# EAGLE design anti1_bot (EAGLE 9.5.1)
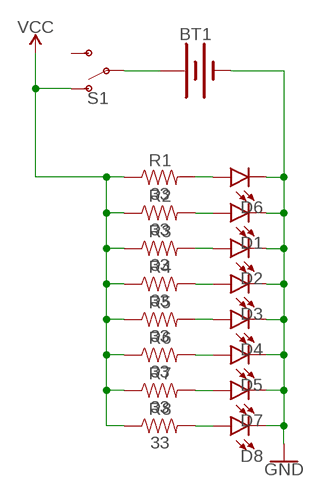
[diagram p0: schematic, sheet 1]

## Parts
BT1  BATTERY-20MM_SMD_4LEGS  [BATTCON_20MM_4LEGS]
D1  LED0603  [LED-0603]
D2  LED0603  [LED-0603]
D3  LED0603  [LED-0603]
D4  LED0603  [LED-0603]
D5  LED0603  [LED-0603]
D6  LED0603  [LED-0603]
D7  LED0603  [LED-0603]
D8  LED0603  [LED-0603]
R1  33  33OHM-0603-1/10W-1%  [0603]
R2  33  33OHM-0603-1/10W-1%  [0603]
R3  33  33OHM-0603-1/10W-1%  [0603]
R4  33  33OHM-0603-1/10W-1%  [0603]
R5  33  33OHM-0603-1/10W-1%  [0603]
R6  33  33OHM-0603-1/10W-1%  [0603]
R7  33  33OHM-0603-1/10W-1%  [0603]
R8  33  33OHM-0603-1/10W-1%  [0603]
S1  SWITCH-SPDT-SMD-AYZ0202  [SWITCH_DPDT_SMD_AYZ0202]

## Nets
GND: BT1.NEGATIVE(-) D1.C D2.C D3.C D4.C D5.C D6.C D7.C D8.C
N$1: BT1.POSITIVE@1(+) BT1.POSITIVE@2(+) BT1.POSITIVE@3(+) BT1.POSITIVE@4(+) S1.2(P)
N$2: D4.A R5.2
N$4: D6.A R1.2
N$5: D1.A R2.2
N$6: D2.A R3.2
N$7: D3.A R4.2
N$8: D5.A R6.2
N$10: D7.A R7.2
N$12: D8.A R8.2
VCC: R1.1 R2.1 R3.1 R4.1 R5.1 R6.1 R7.1 R8.1 S1.1(O)
Unconnected: S1.3(S)

## Library data of the parts
BT1 = SparkFun-Batteries:BATTERY: Battery - Single Cell A variety of battery chemistries, sizes, and footprints. Device List: 20MM_PTH - Coin Cell Battery Holder - 20mm (PTH) <https://www.sparkfun.com/products/783> 20MM_PTH_KIT- Coin Cell battery Holder - 20 mm (PTH) <http://www.sparkfun.com/products/783>kit version with special mask 6.8MM_PTH - Coin Cell Battery Holder - 6.8MM(SMD) <https://www.digikey.com/product-detail/en/seiko-instruments/MS621FE-FL11E/728-1057-ND/1889208?WT.srch=1&gclid=CNOQ5a6LzdQCFZS2wAodXCkE0g> 12MM_SMD - Coin Cell Battery Holder - 12mm (SMD) <https://www.sparkfun.com/products/10592> 12MM_PTH - Coin Cell Battery Holder - 12mm (PTH) <https://www.sparkfun.com/products/7948> 20MM_SMD - 20mm Coin Cell Battery Holder (SMD) (2 legs) Used on the Big Time Watch Kit <https://www.sparkfun.com/products/11734> 20MM_SMD_4LEGS - Coin Cell Battery Holder - 20mm (SMD) <https://www.sparkfun.com/products/11892> 20MM_SMD_4LEGS_OVERPASTE - Coin Cell Battery Holder - 20mm (SMD) <https://www.sparkfun.com/products/11892> (Over-paste on the legs) 24.5MM_PTH - Coin Cell Battery Holder - 24.5mm (PTH) <https://www.sparkfun.com/products/8863> 9V - 9V Battery Holder - PC Mount Used on the SparkFun SparkPunk Sound Kit <https://www.sparkfun.com/products/11177> and SparkFun SparkPunk Sequencer Kit <https://www.sparkfun.com/products/12707> 18650 - Battery Holder - 18650 (PTH) <https://www.sparkfun.com/products/13113> AA - Battery Holder - 1xAA (PTH) <https://www.sparkfun.com/products/7949> AAA - Battery Holder - 1xAAA (PTH) <https://www.sparkfun.com/products/12718> AA_KIT - Battery Holder - 1xAA (PTH) <https://www.sparkfun.com/products/7949> Special kit package - pads only have exposed copper on one side of the board. AAA_KIT - Battery Holder - 1xAAA (PTH) <https://www.sparkfun.com/products/12718> Special kit package - pads only have exposed copper on one side of the board.; PROD_ID: BATT-10373; SF_SKU: PRT-11892
D1-D8 = SparkFun-LED:LED: LED (Generic) Standard schematic elements and footprints for 5mm, 3mm, 1206, and 0603 sized LEDs. Generic LEDs with no color specified.
R1-R8 = SparkFun-Resistors:33OHM: 33Ω resistor A resistor is a passive two-terminal electrical component that implements electrical resistance as a circuit element. Resistors act to reduce current flow, and, at the same time, act to lower voltage levels within circuits. - Wikipedia; PROD_ID: RES-08270
S1 = SparkFun-Switches:SWITCH-SPDT: Single Pole, Double Throw (SPDT) Switch Single-pole, double-throw (SPDT) switch. Variant Overview SMD-AYZ0202 Surface Mount DPDT Switch <https://www.sparkfun.com/products/597> (COM-00597) Used on e.g. LilyPad Arduino USB - ATmega32U4 Board <https://www.sparkfun.com/products/12049> PTH-11.6X4.0MM SPDT Mini Power Switch <https://www.sparkfun.com/products/102> (COM-00102) Used on e.g. SparkFun Simon Says - Through-Hole Soldering Kit <https://www.sparkfun.com/products/10547> (KIT-10547) PTH-11.6X4.0MM-KIT KIT version of SPDT Mini Power Switch - Simplifies soldering by removing tStop of switch pins - only one side can be soldered. PTH-11.6X4.0MM-LOCK LOCK version of SPDT Mini Power Switch - Offset pins hold switch in place for easier soldering. SMD-RIGHT-ANGLE Surface Mount Right Angle Switch <https://www.sparkfun.com/products/10860> (COM-10860) Used on e.g. SparkFun ESP8266 Thing <https://www.sparkfun.com/products/13231>; PROD_ID: SWCH-08179; SF_ID: COM-00597

## Board
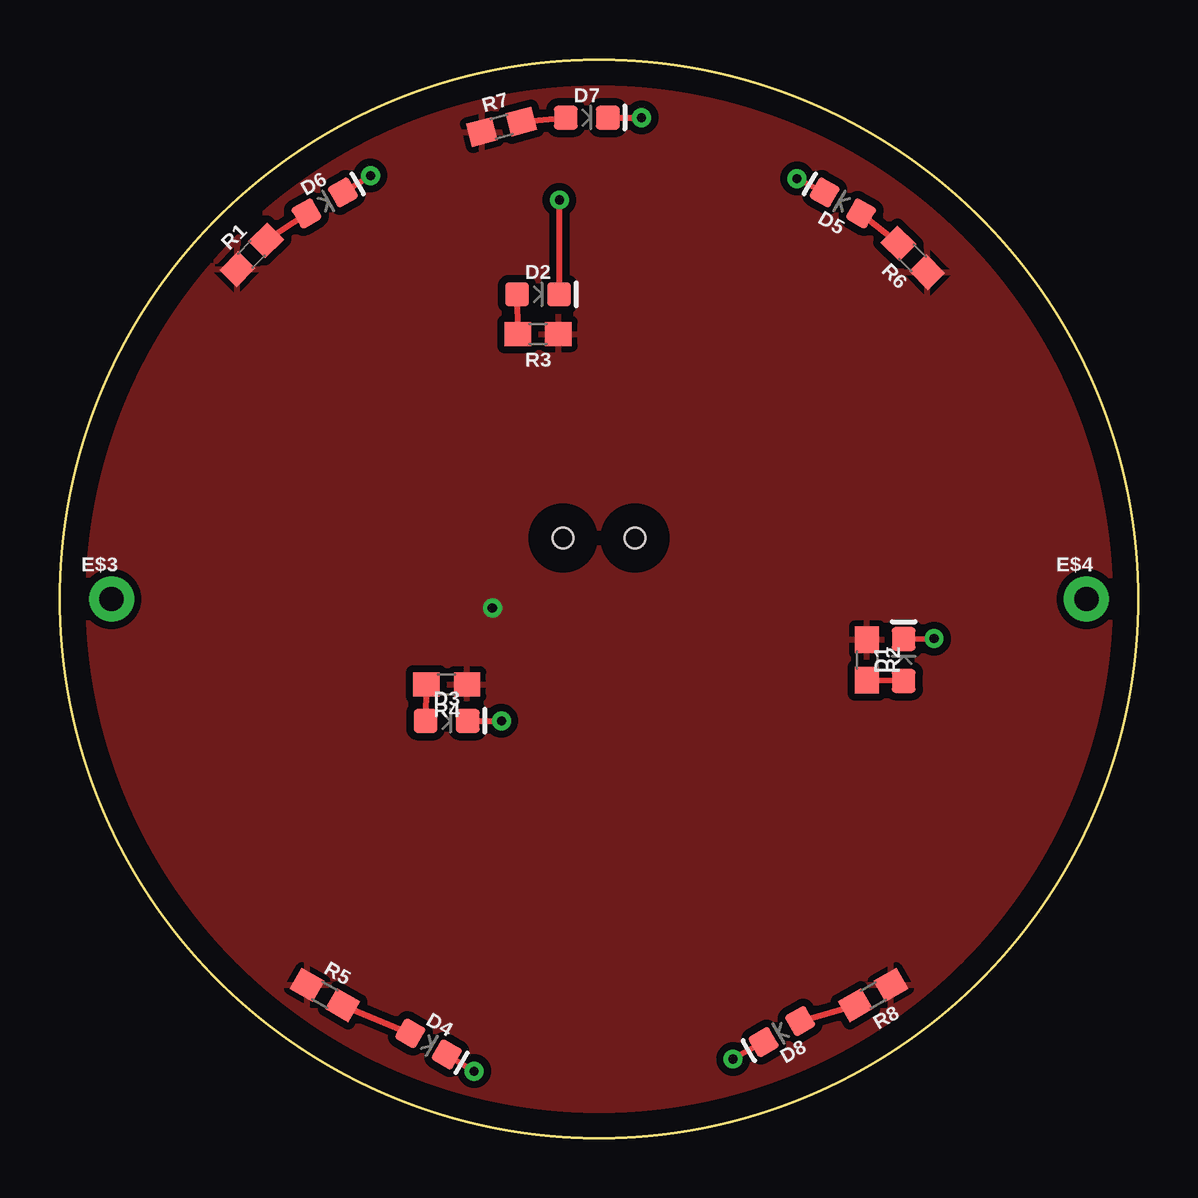
[diagram p1: board, top side]
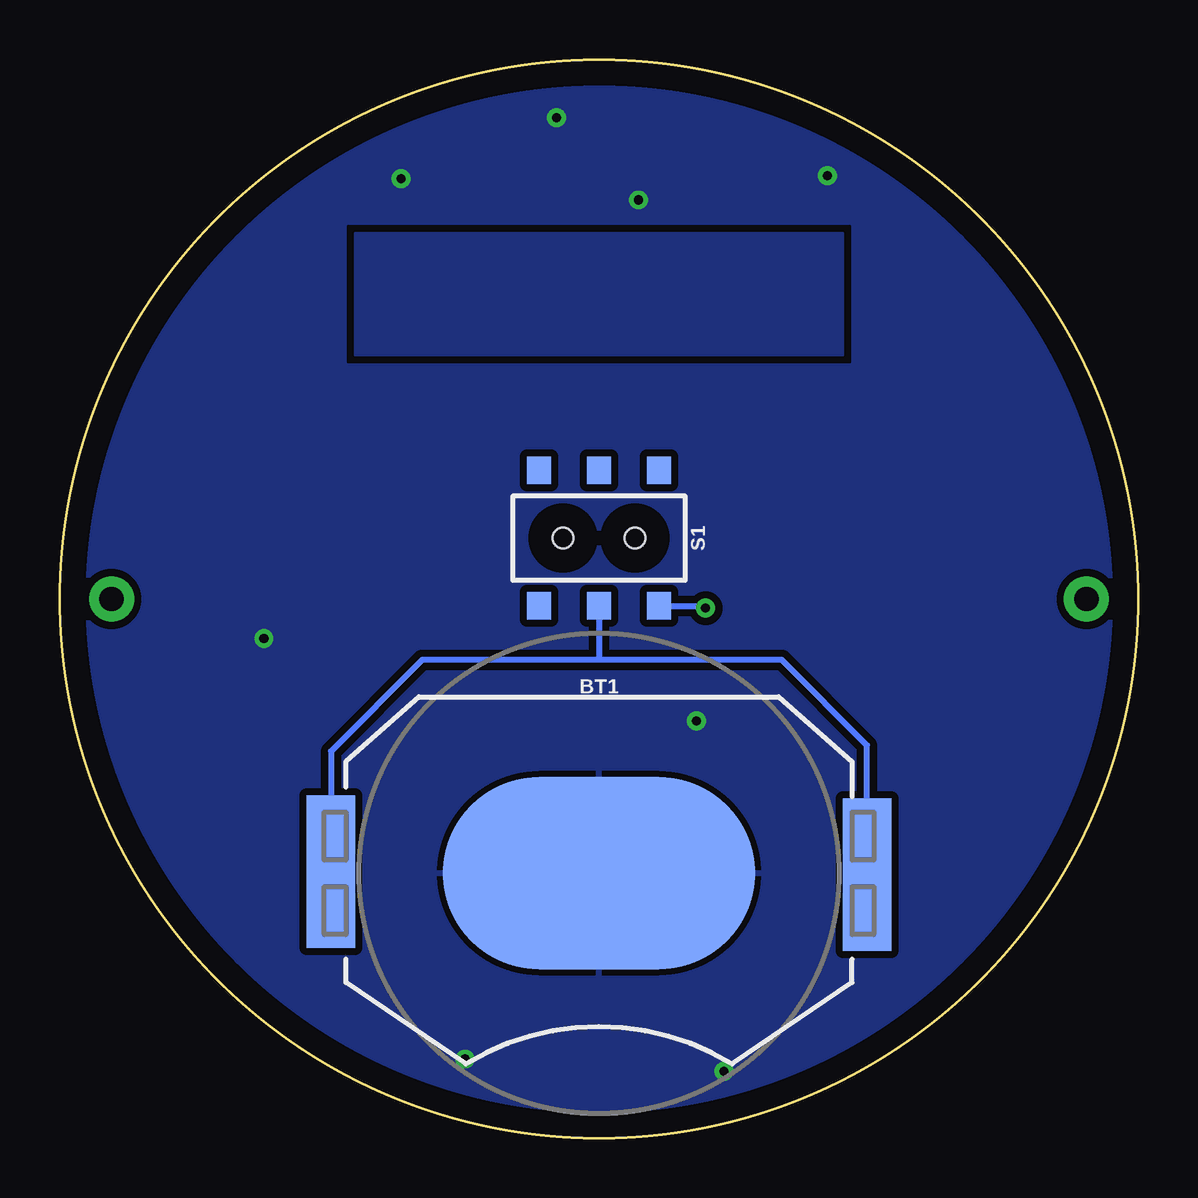
[diagram p2: board, bottom side, seen from below]

Size 44.94 x 44.94 mm. Coordinates in mm from the lower left corner, seen from the top.
Outline: circle at 22.47,22.47 radius 22.47
Copper layers (1*16): Top 0.035mm / dielectric 1.5mm / Bottom 0.035mm
Design rules "default": minimum track width 6mil, minimum drill 0.35mm, track to track 6mil, track to pad 6mil, pad to pad 6mil, via to via 6mil, smd to smd 6mil, copper to edge 40mil, drill to drill 6mil, minimum pad ring 10mil, minimum via ring 8mil, stop-mask expansion 4mil, vias tented up to drill 0mil, thermal gap 10mil

### Footprints (pad centres in the part's own frame; a part is rotated, then mirrored left to right if it is on the bottom)
BATTCON_20MM_4LEGS = smd 13 x 8: NEGATIVE 0,0 | smd 2.032 x 3.175: POSITIVE@1 -11.176,1.651; POSITIVE@2 -11.176,-1.524; POSITIVE@3 11.176,1.524; POSITIVE@4 11.176,-1.651
LED-0603 = smd 1 x 1: A -0.877,0; C 0.877,0
1X01_NO_SILK = drill 1.016 pad 1.88: 1 0,0
0603 = smd 1.1 x 1: 1 -0.85,0; 2 0.85,0
SWITCH_DPDT_SMD_AYZ0202 = smd 1 x 1.15: 1 -2.5,2.825; 2 0,2.825; 3 2.5,2.825; 4 -2.5,-2.825; 5 0,-2.825; 6 2.5,-2.825 | hole 0.85: 1.5,0; -1.5,0

### Placement (x,y rotation side)
BT1  22.47,11.04 0 bottom
D1  35.17,19.93 90 top
D2  19.93,35.17 0 top
D3  16.12,17.39 0 top
D4  15.36,3.93 330 top
D5  32.63,38.98 150 top
D6  11.04,38.98 30 top
D7  21.96,42.53 0 top
D8  30.09,4.43 210 top
E$3  [1X01_NO_SILK]  2.15,22.47 0 top
E$4  [1X01_NO_SILK]  42.79,22.47 0 top
R1  7.99,36.82 45 top
R2  33.64,19.93 270 top
R3  19.93,33.52 180 top
R4  16.12,18.91 180 top
R5  11.04,5.96 330 top
R6  35.55,36.69 135 top
R7  18.4,42.15 15 top
R8  33.9,5.96 210 top
S1  22.47,25.01 180 bottom

### Tracks (layer width: path | path; a pad name or v marks a point on that pad's centre or on a via)
BTN
  pour Bottom (isolate 0.61): 12.31,37.71 32.63,37.71 32.63,32.63 12.31,32.63
GND  (via drill 0.38)
  Top 0.152: D5.C 31.81,39.42 | D2.C 20.82,35.18
  Top 0.254: D6.C v12.94,40.12 | 20.82,35.18 v20.82,39.11 | D7.C v24.25,42.53 | 31.81,39.42 v30.72,39.99 | D1.C v36.44,20.82 | D3.C v18.4,17.39 | D4.C v17.26,2.78 | D8.C v28.06,3.29
  Bottom 0.152: 22.47,7.23 BT1.NEGATIVE 22.47,14.85
  pour Bottom (isolate 0.305, rank 2): -0.01,22.47 arc-90 22.47,44.95 22.6,44.95 arc-90 44.95,22.6 44.95,22.47 arc-90 22.47,-0.01 22.21,-0.01 arc-90 -0.01,22.21
N$1
  Bottom 0.254: 22.47,19.93 14.85,19.93 11.29,16.37 BT1.POSITIVE@3 BT1.POSITIVE@4 | 22.47,19.93 29.83,19.93 33.64,16.12 BT1.POSITIVE@1 BT1.POSITIVE@2 | S1.2 22.47,19.93
N$2
  Top 0.254: R5.2 D4.A
N$4
  Top 0.254: R1.2 D6.A
N$5
  Top 0.254: D1.A R2.2
N$6
  Top 0.254: D2.A R3.2
N$7
  Top 0.254: R4.2 D3.A
N$8
  Top 0.152: D5.A 33.6,38.33
  Top 0.254: D5.A R6.2
N$10
  Top 0.254: R7.2 D7.A
N$12
  Top 0.254: D8.A R8.2
VCC  (via drill 0.38)
  Bottom 0.254: S1.1 18.12,22.18 v18.02,22.09
  pour Top (isolate 0.305): -0.01,22.47 arc-90 22.47,44.95 22.6,44.95 arc-90 44.95,22.6 arc-90 22.34,-0.01 22.21,-0.01 arc-90 -0.01,22.21